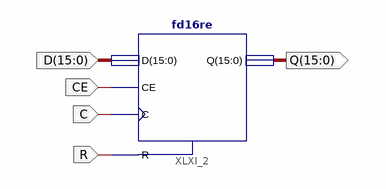
[diagram p0: schematic sheet 1]
// Xilinx ISE schematic register16b.sch (spartan3e) as structural Verilog: 1 symbols, 5 ports
module register16b (
  input  CE,
  input  C,
  input  R,
  input  [15:0] D,
  output [15:0] Q
);

  fd16re XLXI_2 (.C(C), .CE(CE), .D(D), .R(R), .Q(Q));
endmodule
